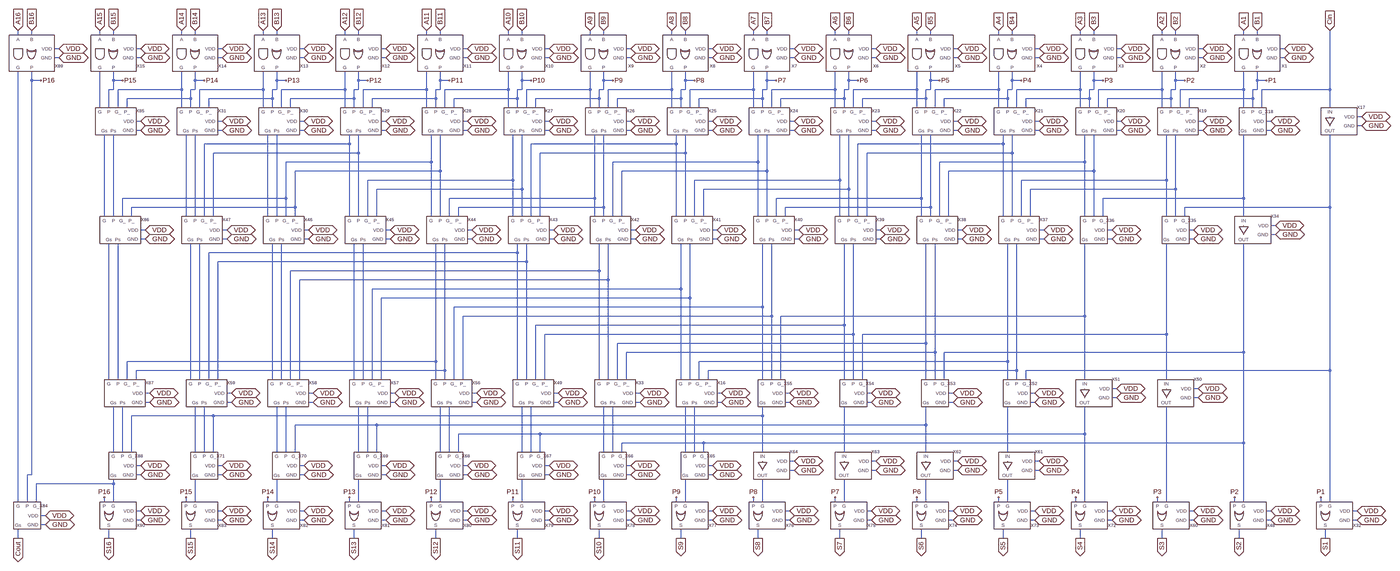
[diagram p0: schematic knowles.asc, whole sheet]
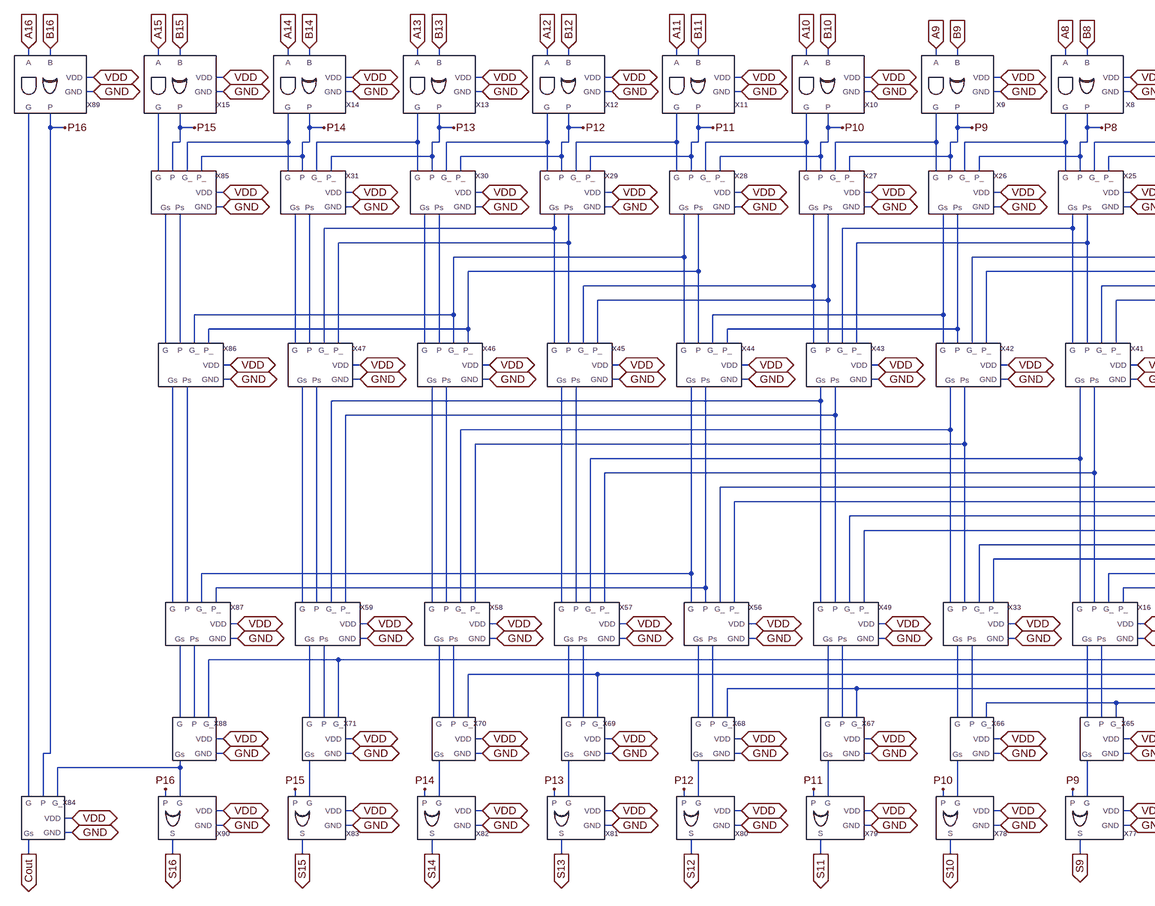
[diagram p1: schematic knowles.asc, part, row 1 of 1, column 1 of 2]
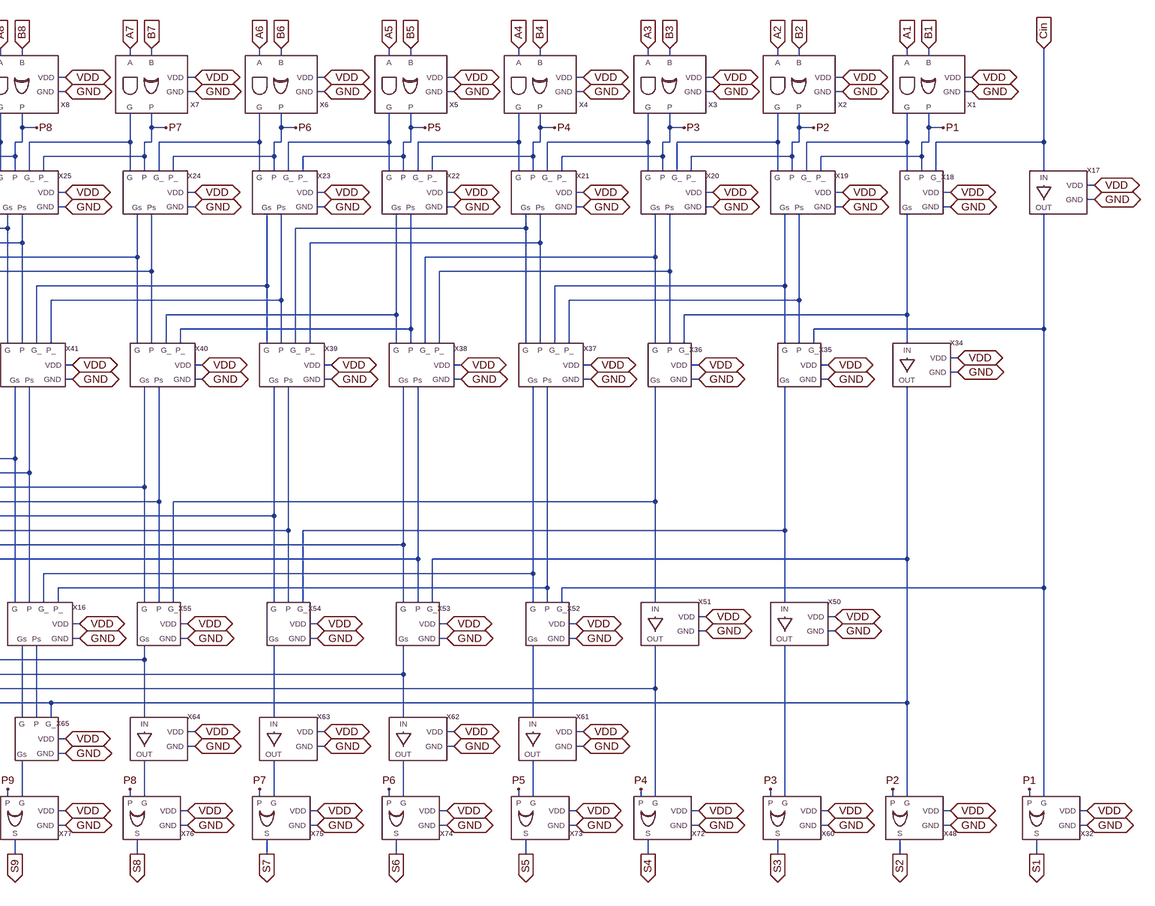
[diagram p2: schematic knowles.asc, part, row 1 of 1, column 2 of 2]
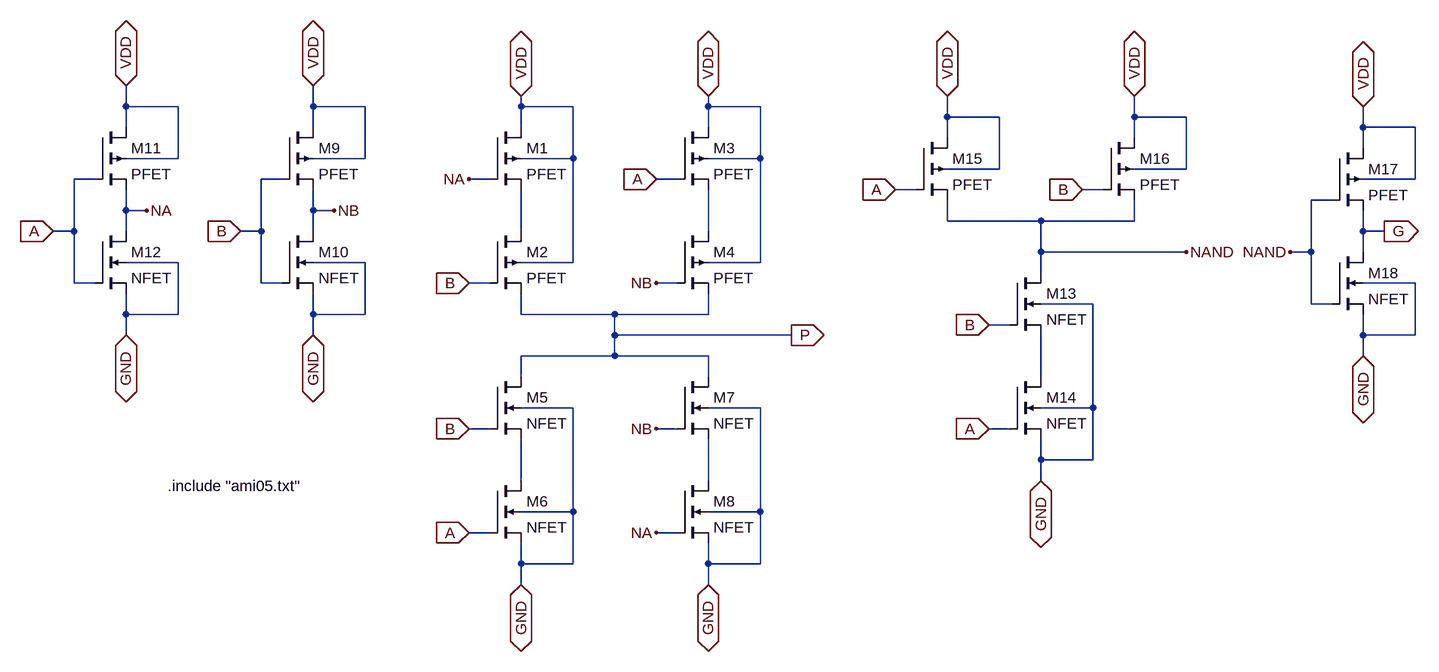
[diagram p3: sub-circuit bitwise.asc]
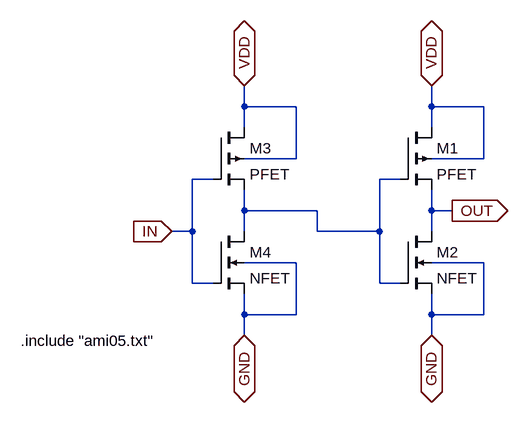
[diagram p4: sub-circuit buffer.asc]
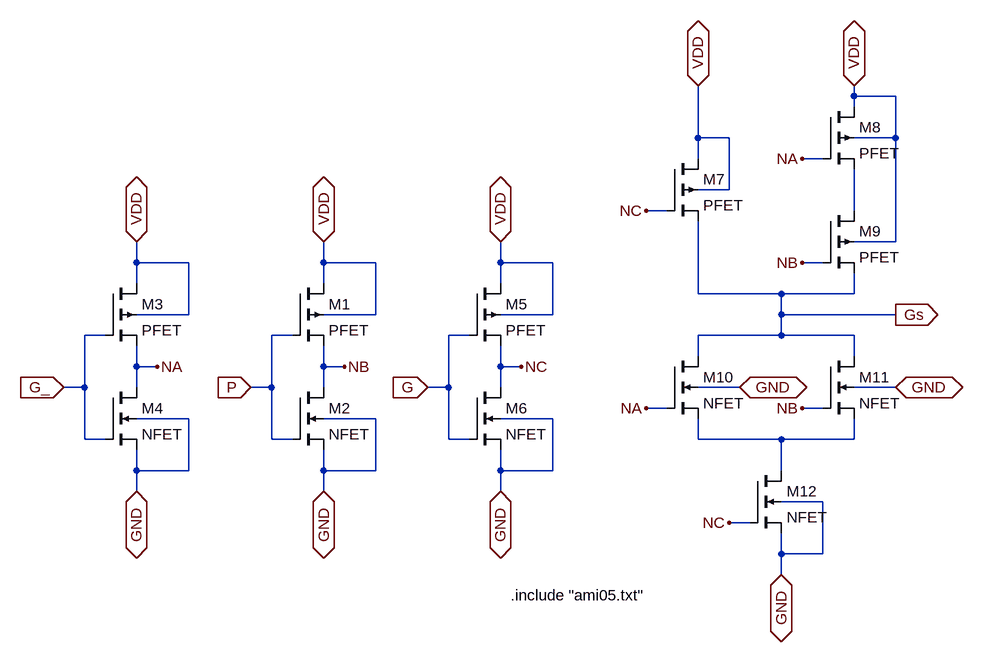
[diagram p5: sub-circuit gray.asc]
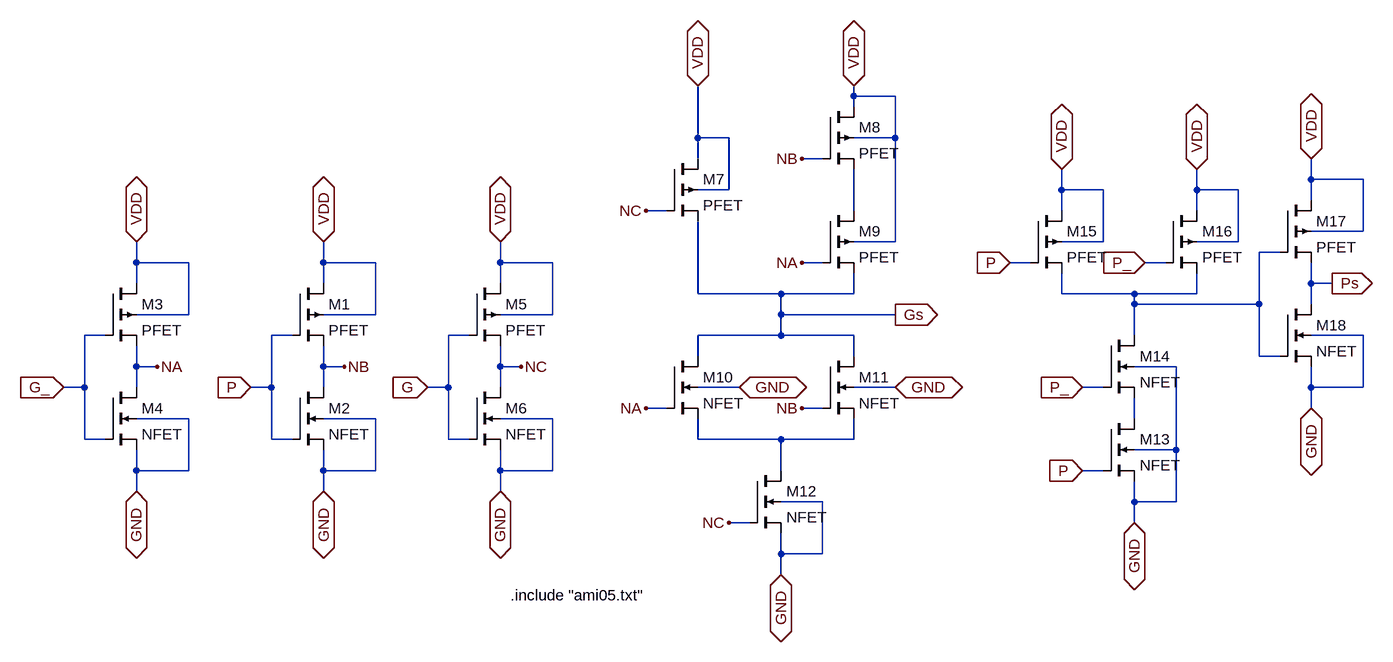
[diagram p6: sub-circuit black.asc]
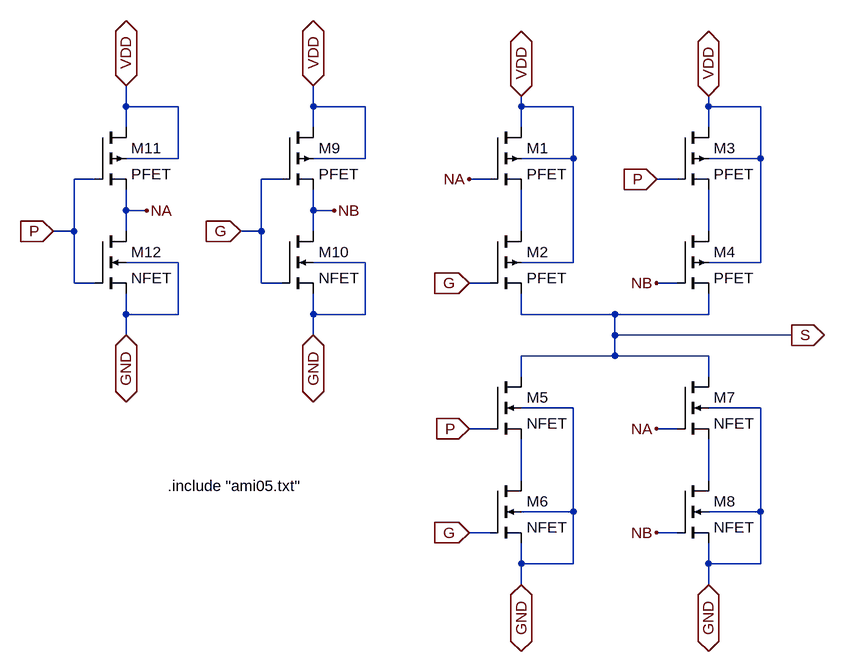
[diagram p7: sub-circuit sum.asc]
knowles.asc, the LTspice schematic file:
Version 4
SHEET 1 880 2148
WIRE -4144 64 -4144 48
WIRE -4096 64 -4096 48
WIRE -3856 64 -3856 48
WIRE -3808 64 -3808 48
WIRE -3568 64 -3568 48
WIRE -3520 64 -3520 48
WIRE -3280 64 -3280 48
WIRE -3232 64 -3232 48
WIRE -2992 64 -2992 48
WIRE -2944 64 -2944 48
WIRE -2704 64 -2704 48
WIRE -2656 64 -2656 48
WIRE -2416 64 -2416 48
WIRE -2368 64 -2368 48
WIRE -2128 64 -2128 48
WIRE -2080 64 -2080 48
WIRE -1840 64 -1840 48
WIRE -1792 64 -1792 48
WIRE -1552 64 -1552 48
WIRE -1504 64 -1504 48
WIRE -1264 64 -1264 48
WIRE -1216 64 -1216 48
WIRE -976 64 -976 48
WIRE -928 64 -928 48
WIRE -688 64 -688 48
WIRE -640 64 -640 48
WIRE -400 64 -400 48
WIRE -352 64 -352 48
WIRE -112 64 -112 48
WIRE -64 64 -64 48
WIRE 176 64 176 48
WIRE 224 64 224 48
WIRE -4000 112 -4016 112
WIRE -3712 112 -3728 112
WIRE -3424 112 -3440 112
WIRE -3136 112 -3152 112
WIRE -2848 112 -2864 112
WIRE -2560 112 -2576 112
WIRE -2272 112 -2288 112
WIRE -1984 112 -2000 112
WIRE -1696 112 -1712 112
WIRE -1408 112 -1424 112
WIRE -1120 112 -1136 112
WIRE -832 112 -848 112
WIRE -544 112 -560 112
WIRE -256 112 -272 112
WIRE 32 112 16 112
WIRE 320 112 304 112
WIRE -4000 144 -4016 144
WIRE -3712 144 -3728 144
WIRE -3424 144 -3440 144
WIRE -3136 144 -3152 144
WIRE -2848 144 -2864 144
WIRE -2560 144 -2576 144
WIRE -2272 144 -2288 144
WIRE -1984 144 -2000 144
WIRE -1696 144 -1712 144
WIRE -1408 144 -1424 144
WIRE -1120 144 -1136 144
WIRE -832 144 -848 144
WIRE -544 144 -560 144
WIRE -256 144 -272 144
WIRE 32 144 16 144
WIRE 320 144 304 144
WIRE -4096 224 -4096 192
WIRE -4064 224 -4096 224
WIRE -3808 224 -3808 192
WIRE -3776 224 -3808 224
WIRE -3520 224 -3520 192
WIRE -3488 224 -3520 224
WIRE -3232 224 -3232 192
WIRE -3200 224 -3232 224
WIRE -2944 224 -2944 192
WIRE -2912 224 -2944 224
WIRE -2656 224 -2656 192
WIRE -2624 224 -2656 224
WIRE -2368 224 -2368 192
WIRE -2336 224 -2368 224
WIRE -2080 224 -2080 192
WIRE -2048 224 -2080 224
WIRE -1792 224 -1792 192
WIRE -1760 224 -1792 224
WIRE -1504 224 -1504 192
WIRE -1472 224 -1504 224
WIRE -1216 224 -1216 192
WIRE -1184 224 -1216 224
WIRE -928 224 -928 192
WIRE -896 224 -928 224
WIRE -640 224 -640 192
WIRE -608 224 -640 224
WIRE -352 224 -352 192
WIRE -320 224 -352 224
WIRE -64 224 -64 192
WIRE -32 224 -64 224
WIRE 224 224 224 192
WIRE 256 224 224 224
WIRE -3808 256 -3808 224
WIRE -3808 256 -3824 256
WIRE -3568 256 -3568 192
WIRE -3568 256 -3792 256
WIRE -3520 256 -3520 224
WIRE -3520 256 -3536 256
WIRE -3280 256 -3280 192
WIRE -3280 256 -3504 256
WIRE -3232 256 -3232 224
WIRE -3232 256 -3248 256
WIRE -2992 256 -2992 192
WIRE -2992 256 -3216 256
WIRE -2944 256 -2944 224
WIRE -2944 256 -2960 256
WIRE -2704 256 -2704 192
WIRE -2704 256 -2928 256
WIRE -2656 256 -2656 224
WIRE -2656 256 -2672 256
WIRE -2416 256 -2416 192
WIRE -2416 256 -2640 256
WIRE -2368 256 -2368 224
WIRE -2368 256 -2384 256
WIRE -2128 256 -2128 192
WIRE -2128 256 -2352 256
WIRE -2080 256 -2080 224
WIRE -2080 256 -2096 256
WIRE -1840 256 -1840 192
WIRE -1840 256 -2064 256
WIRE -1792 256 -1792 224
WIRE -1792 256 -1808 256
WIRE -1552 256 -1552 192
WIRE -1552 256 -1776 256
WIRE -1504 256 -1504 224
WIRE -1504 256 -1520 256
WIRE -1264 256 -1264 192
WIRE -1264 256 -1488 256
WIRE -1216 256 -1216 224
WIRE -1216 256 -1232 256
WIRE -976 256 -976 192
WIRE -976 256 -1200 256
WIRE -928 256 -928 224
WIRE -928 256 -944 256
WIRE -688 256 -688 192
WIRE -688 256 -912 256
WIRE -640 256 -640 224
WIRE -640 256 -656 256
WIRE -400 256 -400 192
WIRE -400 256 -624 256
WIRE -352 256 -352 224
WIRE -352 256 -368 256
WIRE -112 256 -112 192
WIRE -112 256 -336 256
WIRE -64 256 -64 224
WIRE -64 256 -80 256
WIRE 176 256 176 192
WIRE 176 256 -48 256
WIRE 224 256 224 224
WIRE 224 256 208 256
WIRE 480 256 480 48
WIRE 480 256 240 256
WIRE -3536 288 -3536 256
WIRE -3536 288 -3760 288
WIRE -3248 288 -3248 256
WIRE -3248 288 -3472 288
WIRE -2960 288 -2960 256
WIRE -2960 288 -3184 288
WIRE -2672 288 -2672 256
WIRE -2672 288 -2896 288
WIRE -2384 288 -2384 256
WIRE -2384 288 -2608 288
WIRE -2096 288 -2096 256
WIRE -2096 288 -2320 288
WIRE -1808 288 -1808 256
WIRE -1808 288 -2032 288
WIRE -1520 288 -1520 256
WIRE -1520 288 -1744 288
WIRE -1232 288 -1232 256
WIRE -1232 288 -1456 288
WIRE -944 288 -944 256
WIRE -944 288 -1168 288
WIRE -656 288 -656 256
WIRE -656 288 -880 288
WIRE -368 288 -368 256
WIRE -368 288 -592 288
WIRE -80 288 -80 256
WIRE -80 288 -304 288
WIRE 208 288 208 256
WIRE 208 288 -16 288
WIRE -3856 320 -3856 192
WIRE -3824 320 -3824 256
WIRE -3792 320 -3792 256
WIRE -3760 320 -3760 288
WIRE -3568 320 -3568 256
WIRE -3536 320 -3536 288
WIRE -3504 320 -3504 256
WIRE -3472 320 -3472 288
WIRE -3280 320 -3280 256
WIRE -3248 320 -3248 288
WIRE -3216 320 -3216 256
WIRE -3184 320 -3184 288
WIRE -2992 320 -2992 256
WIRE -2960 320 -2960 288
WIRE -2928 320 -2928 256
WIRE -2896 320 -2896 288
WIRE -2704 320 -2704 256
WIRE -2672 320 -2672 288
WIRE -2640 320 -2640 256
WIRE -2608 320 -2608 288
WIRE -2416 320 -2416 256
WIRE -2384 320 -2384 288
WIRE -2352 320 -2352 256
WIRE -2320 320 -2320 288
WIRE -2128 320 -2128 256
WIRE -2096 320 -2096 288
WIRE -2064 320 -2064 256
WIRE -2032 320 -2032 288
WIRE -1840 320 -1840 256
WIRE -1808 320 -1808 288
WIRE -1776 320 -1776 256
WIRE -1744 320 -1744 288
WIRE -1552 320 -1552 256
WIRE -1520 320 -1520 288
WIRE -1488 320 -1488 256
WIRE -1456 320 -1456 288
WIRE -1264 320 -1264 256
WIRE -1232 320 -1232 288
WIRE -1200 320 -1200 256
WIRE -1168 320 -1168 288
WIRE -976 320 -976 256
WIRE -944 320 -944 288
WIRE -912 320 -912 256
WIRE -880 320 -880 288
WIRE -688 320 -688 256
WIRE -656 320 -656 288
WIRE -624 320 -624 256
WIRE -592 320 -592 288
WIRE -400 320 -400 256
WIRE -368 320 -368 288
WIRE -336 320 -336 256
WIRE -304 320 -304 288
WIRE -112 320 -112 256
WIRE -80 320 -80 288
WIRE -48 320 -48 256
WIRE -16 320 -16 288
WIRE 176 320 176 256
WIRE 208 320 208 288
WIRE 240 320 240 256
WIRE 480 320 480 256
WIRE 592 352 576 352
WIRE -3712 368 -3728 368
WIRE -3424 368 -3440 368
WIRE -3136 368 -3152 368
WIRE -2848 368 -2864 368
WIRE -2560 368 -2576 368
WIRE -2272 368 -2288 368
WIRE -1984 368 -2000 368
WIRE -1696 368 -1712 368
WIRE -1408 368 -1424 368
WIRE -1120 368 -1136 368
WIRE -832 368 -848 368
WIRE -544 368 -560 368
WIRE -256 368 -272 368
WIRE 32 368 16 368
WIRE 272 368 256 368
WIRE 592 384 576 384
WIRE -3712 400 -3728 400
WIRE -3424 400 -3440 400
WIRE -3136 400 -3152 400
WIRE -2848 400 -2864 400
WIRE -2560 400 -2576 400
WIRE -2272 400 -2288 400
WIRE -1984 400 -2000 400
WIRE -1696 400 -1712 400
WIRE -1408 400 -1424 400
WIRE -1120 400 -1136 400
WIRE -832 400 -848 400
WIRE -544 400 -560 400
WIRE -256 400 -272 400
WIRE 32 400 16 400
WIRE 272 400 256 400
WIRE -2976 448 -2976 416
WIRE -2976 448 -3488 448
WIRE -1824 448 -1824 416
WIRE -1824 448 -2336 448
WIRE -672 448 -672 416
WIRE -672 448 -1184 448
WIRE -2944 480 -2944 416
WIRE -2944 480 -3456 480
WIRE -1792 480 -1792 416
WIRE -1792 480 -2304 480
WIRE -640 480 -640 416
WIRE -640 480 -1152 480
WIRE -2688 512 -2688 416
WIRE -2688 512 -3200 512
WIRE -1536 512 -1536 416
WIRE -1536 512 -2048 512
WIRE -384 512 -384 416
WIRE -384 512 -896 512
WIRE -2656 544 -2656 416
WIRE -2656 544 -3168 544
WIRE -1504 544 -1504 416
WIRE -1504 544 -2016 544
WIRE -352 544 -352 416
WIRE -352 544 -864 544
WIRE -2400 576 -2400 416
WIRE -2400 576 -2912 576
WIRE -1248 576 -1248 416
WIRE -1248 576 -1760 576
WIRE -96 576 -96 416
WIRE -96 576 -608 576
WIRE -2368 608 -2368 416
WIRE -2368 608 -2880 608
WIRE -1216 608 -1216 416
WIRE -1216 608 -1728 608
WIRE -64 608 -64 416
WIRE -64 608 -576 608
WIRE -3200 640 -3200 512
WIRE -3200 640 -3776 640
WIRE -2112 640 -2112 416
WIRE -2112 640 -2624 640
WIRE -960 640 -960 416
WIRE -960 640 -1472 640
WIRE 176 640 176 416
WIRE 176 640 -320 640
WIRE -3168 672 -3168 544
WIRE -3168 672 -3744 672
WIRE -2080 672 -2080 416
WIRE -2080 672 -2592 672
WIRE -928 672 -928 416
WIRE -928 672 -1440 672
WIRE 480 672 480 416
WIRE 480 672 -32 672
WIRE -3840 704 -3840 416
WIRE -3808 704 -3808 416
WIRE -3776 704 -3776 640
WIRE -3744 704 -3744 672
WIRE -3552 704 -3552 416
WIRE -3520 704 -3520 416
WIRE -3488 704 -3488 448
WIRE -3456 704 -3456 480
WIRE -3264 704 -3264 416
WIRE -3232 704 -3232 416
WIRE -3200 704 -3200 640
WIRE -3168 704 -3168 672
WIRE -2976 704 -2976 448
WIRE -2944 704 -2944 480
WIRE -2912 704 -2912 576
WIRE -2880 704 -2880 608
WIRE -2688 704 -2688 512
WIRE -2656 704 -2656 544
WIRE -2624 704 -2624 640
WIRE -2592 704 -2592 672
WIRE -2400 704 -2400 576
WIRE -2368 704 -2368 608
WIRE -2336 704 -2336 448
WIRE -2304 704 -2304 480
WIRE -2112 704 -2112 640
WIRE -2080 704 -2080 672
WIRE -2048 704 -2048 512
WIRE -2016 704 -2016 544
WIRE -1824 704 -1824 448
WIRE -1792 704 -1792 480
WIRE -1760 704 -1760 576
WIRE -1728 704 -1728 608
WIRE -1536 704 -1536 512
WIRE -1504 704 -1504 544
WIRE -1472 704 -1472 640
WIRE -1440 704 -1440 672
WIRE -1248 704 -1248 576
WIRE -1216 704 -1216 608
WIRE -1184 704 -1184 448
WIRE -1152 704 -1152 480
WIRE -960 704 -960 640
WIRE -928 704 -928 672
WIRE -896 704 -896 512
WIRE -864 704 -864 544
WIRE -672 704 -672 448
WIRE -640 704 -640 480
WIRE -608 704 -608 576
WIRE -576 704 -576 608
WIRE -384 704 -384 512
WIRE -352 704 -352 544
WIRE -320 704 -320 640
WIRE -96 704 -96 576
WIRE -64 704 -64 608
WIRE -32 704 -32 672
WIRE 176 704 176 640
WIRE 288 736 272 736
WIRE -3696 752 -3712 752
WIRE -3408 752 -3424 752
WIRE -3120 752 -3136 752
WIRE -2832 752 -2848 752
WIRE -2544 752 -2560 752
WIRE -2256 752 -2272 752
WIRE -1968 752 -1984 752
WIRE -1680 752 -1696 752
WIRE -1392 752 -1408 752
WIRE -1104 752 -1120 752
WIRE -816 752 -832 752
WIRE -528 752 -544 752
WIRE -288 752 -304 752
WIRE 0 752 -16 752
WIRE 288 768 272 768
WIRE -3696 784 -3712 784
WIRE -3408 784 -3424 784
WIRE -3120 784 -3136 784
WIRE -2832 784 -2848 784
WIRE -2544 784 -2560 784
WIRE -2256 784 -2272 784
WIRE -1968 784 -1984 784
WIRE -1680 784 -1696 784
WIRE -1392 784 -1408 784
WIRE -1104 784 -1120 784
WIRE -816 784 -832 784
WIRE -528 784 -544 784
WIRE -288 784 -304 784
WIRE 0 784 -16 784
WIRE -2384 832 -2384 800
WIRE -2384 832 -3472 832
WIRE -2352 864 -2352 800
WIRE -2352 864 -3440 864
WIRE -2096 896 -2096 800
WIRE -2096 896 -3184 896
WIRE -2064 928 -2064 800
WIRE -2064 928 -3152 928
WIRE -1808 960 -1808 800
WIRE -1808 960 -2896 960
WIRE -1776 992 -1776 800
WIRE -1776 992 -2864 992
WIRE -1520 1024 -1520 800
WIRE -1520 1024 -2608 1024
WIRE -1488 1056 -1488 800
WIRE -1488 1056 -2576 1056
WIRE -384 1056 -384 800
WIRE -384 1056 -1456 1056
WIRE -1232 1088 -1232 800
WIRE -1232 1088 -2320 1088
WIRE -1200 1120 -1200 800
WIRE -1200 1120 -2288 1120
WIRE -96 1120 -96 800
WIRE -96 1120 -1168 1120
WIRE -944 1152 -944 800
WIRE -944 1152 -2032 1152
WIRE -912 1184 -912 800
WIRE -912 1184 -2000 1184
WIRE 176 1184 176 800
WIRE 176 1184 -880 1184
WIRE -2672 1216 -2672 800
WIRE -2672 1216 -3760 1216
WIRE -656 1216 -656 800
WIRE -656 1216 -1744 1216
WIRE -2640 1248 -2640 800
WIRE -2640 1248 -3728 1248
WIRE -624 1248 -624 800
WIRE -624 1248 -1712 1248
WIRE 480 1248 480 672
WIRE 480 1248 -592 1248
WIRE -3824 1280 -3824 800
WIRE -3792 1280 -3792 800
WIRE -3760 1280 -3760 1216
WIRE -3728 1280 -3728 1248
WIRE -3536 1280 -3536 800
WIRE -3504 1280 -3504 800
WIRE -3472 1280 -3472 832
WIRE -3440 1280 -3440 864
WIRE -3248 1280 -3248 800
WIRE -3216 1280 -3216 800
WIRE -3184 1280 -3184 896
WIRE -3152 1280 -3152 928
WIRE -2960 1280 -2960 800
WIRE -2928 1280 -2928 800
WIRE -2896 1280 -2896 960
WIRE -2864 1280 -2864 992
WIRE -2672 1280 -2672 1216
WIRE -2640 1280 -2640 1248
WIRE -2608 1280 -2608 1024
WIRE -2576 1280 -2576 1056
WIRE -2384 1280 -2384 832
WIRE -2352 1280 -2352 864
WIRE -2320 1280 -2320 1088
WIRE -2288 1280 -2288 1120
WIRE -2096 1280 -2096 896
WIRE -2064 1280 -2064 928
WIRE -2032 1280 -2032 1152
WIRE -2000 1280 -2000 1184
WIRE -1808 1280 -1808 960
WIRE -1776 1280 -1776 992
WIRE -1744 1280 -1744 1216
WIRE -1712 1280 -1712 1248
WIRE -1520 1280 -1520 1024
WIRE -1488 1280 -1488 1056
WIRE -1456 1280 -1456 1056
WIRE -1232 1280 -1232 1088
WIRE -1200 1280 -1200 1120
WIRE -1168 1280 -1168 1120
WIRE -944 1280 -944 1152
WIRE -912 1280 -912 1184
WIRE -880 1280 -880 1184
WIRE -656 1280 -656 1216
WIRE -624 1280 -624 1248
WIRE -592 1280 -592 1248
WIRE -384 1280 -384 1056
WIRE -96 1280 -96 1120
WIRE -272 1312 -288 1312
WIRE 16 1312 0 1312
WIRE -3680 1328 -3696 1328
WIRE -3392 1328 -3408 1328
WIRE -3104 1328 -3120 1328
WIRE -2816 1328 -2832 1328
WIRE -2528 1328 -2544 1328
WIRE -2240 1328 -2256 1328
WIRE -1952 1328 -1968 1328
WIRE -1664 1328 -1680 1328
WIRE -1424 1328 -1440 1328
WIRE -1136 1328 -1152 1328
WIRE -848 1328 -864 1328
WIRE -560 1328 -576 1328
WIRE -272 1344 -288 1344
WIRE 16 1344 0 1344
WIRE -3680 1360 -3696 1360
WIRE -3392 1360 -3408 1360
WIRE -3104 1360 -3120 1360
WIRE -2816 1360 -2832 1360
WIRE -2528 1360 -2544 1360
WIRE -2240 1360 -2256 1360
WIRE -1952 1360 -1968 1360
WIRE -1664 1360 -1680 1360
WIRE -1424 1360 -1440 1360
WIRE -1136 1360 -1152 1360
WIRE -848 1360 -864 1360
WIRE -560 1360 -576 1360
WIRE -3456 1408 -3744 1408
WIRE -1520 1408 -1520 1376
WIRE -1520 1408 -3456 1408
WIRE -2880 1440 -3168 1440
WIRE -944 1440 -944 1376
WIRE -944 1440 -2880 1440
WIRE -2304 1472 -2592 1472
WIRE -384 1472 -384 1376
WIRE -384 1472 -2304 1472
WIRE -1728 1504 -2016 1504
WIRE 176 1504 176 1184
WIRE 176 1504 -1728 1504
WIRE -3808 1536 -3808 1376
WIRE -3776 1536 -3776 1376
WIRE -3744 1536 -3744 1408
WIRE -3520 1536 -3520 1376
WIRE -3488 1536 -3488 1376
WIRE -3456 1536 -3456 1408
WIRE -3232 1536 -3232 1376
WIRE -3200 1536 -3200 1376
WIRE -3168 1536 -3168 1440
WIRE -2944 1536 -2944 1376
WIRE -2912 1536 -2912 1376
WIRE -2880 1536 -2880 1440
WIRE -2656 1536 -2656 1376
WIRE -2624 1536 -2624 1376
WIRE -2592 1536 -2592 1472
WIRE -2368 1536 -2368 1376
WIRE -2336 1536 -2336 1376
WIRE -2304 1536 -2304 1472
WIRE -2080 1536 -2080 1376
WIRE -2048 1536 -2048 1376
WIRE -2016 1536 -2016 1504
WIRE -1792 1536 -1792 1376
WIRE -1760 1536 -1760 1376
WIRE -1728 1536 -1728 1504
WIRE -1520 1536 -1520 1408
WIRE -1232 1536 -1232 1376
WIRE -944 1536 -944 1440
WIRE -656 1536 -656 1376
WIRE -1408 1568 -1424 1568
WIRE -1120 1568 -1136 1568
WIRE -832 1568 -848 1568
WIRE -544 1568 -560 1568
WIRE -3712 1584 -3728 1584
WIRE -3424 1584 -3440 1584
WIRE -3136 1584 -3152 1584
WIRE -2848 1584 -2864 1584
WIRE -2560 1584 -2576 1584
WIRE -2272 1584 -2288 1584
WIRE -1984 1584 -2000 1584
WIRE -1696 1584 -1712 1584
WIRE -1408 1600 -1424 1600
WIRE -1120 1600 -1136 1600
WIRE -832 1600 -848 1600
WIRE -544 1600 -560 1600
WIRE -4096 1616 -4096 224
WIRE -4096 1616 -4112 1616
WIRE -3712 1616 -3728 1616
WIRE -3424 1616 -3440 1616
WIRE -3136 1616 -3152 1616
WIRE -2848 1616 -2864 1616
WIRE -2560 1616 -2576 1616
WIRE -2272 1616 -2288 1616
WIRE -1984 1616 -2000 1616
WIRE -1696 1616 -1712 1616
WIRE -3808 1648 -3808 1632
WIRE -3808 1648 -4080 1648
WIRE -4144 1712 -4144 192
WIRE -4112 1712 -4112 1616
WIRE -4080 1712 -4080 1648
WIRE -3840 1712 -3840 1696
WIRE -3808 1712 -3808 1648
WIRE -3552 1712 -3552 1696
WIRE -3520 1712 -3520 1632
WIRE -3264 1712 -3264 1696
WIRE -3232 1712 -3232 1632
WIRE -2976 1712 -2976 1696
WIRE -2944 1712 -2944 1632
WIRE -2688 1712 -2688 1696
WIRE -2656 1712 -2656 1632
WIRE -2400 1712 -2400 1696
WIRE -2368 1712 -2368 1632
WIRE -2112 1712 -2112 1696
WIRE -2080 1712 -2080 1632
WIRE -1824 1712 -1824 1696
WIRE -1792 1712 -1792 1632
WIRE -1552 1712 -1552 1696
WIRE -1520 1712 -1520 1632
WIRE -1264 1712 -1264 1696
WIRE -1232 1712 -1232 1632
WIRE -976 1712 -976 1696
WIRE -944 1712 -944 1632
WIRE -688 1712 -688 1696
WIRE -656 1712 -656 1632
WIRE -416 1712 -416 1696
WIRE -384 1712 -384 1472
WIRE -128 1712 -128 1696
WIRE -96 1712 -96 1376
WIRE 144 1712 144 1696
WIRE 176 1712 176 1504
WIRE 448 1712 448 1696
WIRE 480 1712 480 1248
WIRE -3712 1744 -3728 1744
WIRE -3424 1744 -3440 1744
WIRE -3136 1744 -3152 1744
WIRE -2848 1744 -2864 1744
WIRE -2560 1744 -2576 1744
WIRE -2272 1744 -2288 1744
WIRE -1984 1744 -2000 1744
WIRE -1696 1744 -1712 1744
WIRE -1424 1744 -1440 1744
WIRE -1136 1744 -1152 1744
WIRE -848 1744 -864 1744
WIRE -560 1744 -576 1744
WIRE -288 1744 -304 1744
WIRE 0 1744 -16 1744
WIRE 272 1744 256 1744
WIRE 576 1744 560 1744
WIRE -4048 1760 -4064 1760
WIRE -3712 1776 -3728 1776
WIRE -3424 1776 -3440 1776
WIRE -3136 1776 -3152 1776
WIRE -2848 1776 -2864 1776
WIRE -2560 1776 -2576 1776
WIRE -2272 1776 -2288 1776
WIRE -1984 1776 -2000 1776
WIRE -1696 1776 -1712 1776
WIRE -1424 1776 -1440 1776
WIRE -1136 1776 -1152 1776
WIRE -848 1776 -864 1776
WIRE -560 1776 -576 1776
WIRE -288 1776 -304 1776
WIRE 0 1776 -16 1776
WIRE 272 1776 256 1776
WIRE 576 1776 560 1776
WIRE -4048 1792 -4064 1792
WIRE -4144 1840 -4144 1808
WIRE -3824 1840 -3824 1808
WIRE -3536 1840 -3536 1808
WIRE -3248 1840 -3248 1808
WIRE -2960 1840 -2960 1808
WIRE -2672 1840 -2672 1808
WIRE -2384 1840 -2384 1808
WIRE -2096 1840 -2096 1808
WIRE -1808 1840 -1808 1808
WIRE -1536 1840 -1536 1808
WIRE -1248 1840 -1248 1808
WIRE -960 1840 -960 1808
WIRE -672 1840 -672 1808
WIRE -400 1840 -400 1808
WIRE -112 1840 -112 1808
WIRE 160 1840 160 1808
WIRE 464 1840 464 1808
FLAG 320 112 VDD
IOPIN 320 112 BiDir
FLAG 320 144 GND
IOPIN 320 144 BiDir
FLAG 176 48 A1
IOPIN 176 48 In
FLAG 224 48 B1
IOPIN 224 48 In
FLAG 32 112 VDD
IOPIN 32 112 BiDir
FLAG 32 144 GND
IOPIN 32 144 BiDir
FLAG -112 48 A2
IOPIN -112 48 In
FLAG -64 48 B2
IOPIN -64 48 In
FLAG -256 112 VDD
IOPIN -256 112 BiDir
FLAG -256 144 GND
IOPIN -256 144 BiDir
FLAG -400 48 A3
IOPIN -400 48 In
FLAG -352 48 B3
IOPIN -352 48 In
FLAG -544 112 VDD
IOPIN -544 112 BiDir
FLAG -544 144 GND
IOPIN -544 144 BiDir
FLAG -688 48 A4
IOPIN -688 48 In
FLAG -640 48 B4
IOPIN -640 48 In
FLAG -832 112 VDD
IOPIN -832 112 BiDir
FLAG -832 144 GND
IOPIN -832 144 BiDir
FLAG -976 48 A5
IOPIN -976 48 In
FLAG -928 48 B5
IOPIN -928 48 In
FLAG -1120 112 VDD
IOPIN -1120 112 BiDir
FLAG -1120 144 GND
IOPIN -1120 144 BiDir
FLAG -1264 48 A6
IOPIN -1264 48 In
FLAG -1216 48 B6
IOPIN -1216 48 In
FLAG -1408 112 VDD
IOPIN -1408 112 BiDir
FLAG -1408 144 GND
IOPIN -1408 144 BiDir
FLAG -1552 48 A7
IOPIN -1552 48 In
FLAG -1504 48 B7
IOPIN -1504 48 In
FLAG -1696 112 VDD
IOPIN -1696 112 BiDir
FLAG -1696 144 GND
IOPIN -1696 144 BiDir
FLAG -1840 48 A8
IOPIN -1840 48 In
FLAG -1792 48 B8
IOPIN -1792 48 In
FLAG -1984 112 VDD
IOPIN -1984 112 BiDir
FLAG -1984 144 GND
IOPIN -1984 144 BiDir
FLAG -2128 48 A9
IOPIN -2128 48 In
FLAG -2080 48 B9
IOPIN -2080 48 In
FLAG -2272 112 VDD
IOPIN -2272 112 BiDir
FLAG -2272 144 GND
IOPIN -2272 144 BiDir
FLAG -2416 48 A10
IOPIN -2416 48 In
FLAG -2368 48 B10
IOPIN -2368 48 In
FLAG -2560 112 VDD
IOPIN -2560 112 BiDir
FLAG -2560 144 GND
IOPIN -2560 144 BiDir
FLAG -2704 48 A11
IOPIN -2704 48 In
FLAG -2656 48 B11
IOPIN -2656 48 In
FLAG -2848 112 VDD
IOPIN -2848 112 BiDir
FLAG -2848 144 GND
IOPIN -2848 144 BiDir
FLAG -2992 48 A12
IOPIN -2992 48 In
FLAG -2944 48 B12
IOPIN -2944 48 In
FLAG -3136 112 VDD
IOPIN -3136 112 BiDir
FLAG -3136 144 GND
IOPIN -3136 144 BiDir
FLAG -3280 48 A13
IOPIN -3280 48 In
FLAG -3232 48 B13
IOPIN -3232 48 In
FLAG -3424 112 VDD
IOPIN -3424 112 BiDir
FLAG -3424 144 GND
IOPIN -3424 144 BiDir
FLAG -3568 48 A14
IOPIN -3568 48 In
FLAG -3520 48 B14
IOPIN -3520 48 In
FLAG -3712 112 VDD
IOPIN -3712 112 BiDir
FLAG -3712 144 GND
IOPIN -3712 144 BiDir
FLAG -3856 48 A15
IOPIN -3856 48 In
FLAG -3808 48 B15
IOPIN -3808 48 In
FLAG 480 48 Cin
IOPIN 480 48 In
FLAG 592 352 VDD
IOPIN 592 352 BiDir
FLAG 592 384 GND
IOPIN 592 384 BiDir
FLAG 272 368 VDD
IOPIN 272 368 BiDir
FLAG 272 400 GND
IOPIN 272 400 BiDir
FLAG 288 736 VDD
IOPIN 288 736 BiDir
FLAG 288 768 GND
IOPIN 288 768 BiDir
FLAG 0 752 VDD
IOPIN 0 752 BiDir
FLAG 0 784 GND
IOPIN 0 784 BiDir
FLAG -288 752 VDD
IOPIN -288 752 BiDir
FLAG -288 784 GND
IOPIN -288 784 BiDir
FLAG 32 368 VDD
IOPIN 32 368 BiDir
FLAG 32 400 GND
IOPIN 32 400 BiDir
FLAG -256 368 VDD
IOPIN -256 368 BiDir
FLAG -256 400 GND
IOPIN -256 400 BiDir
FLAG -544 368 VDD
IOPIN -544 368 BiDir
FLAG -544 400 GND
IOPIN -544 400 BiDir
FLAG -832 368 VDD
IOPIN -832 368 BiDir
FLAG -832 400 GND
IOPIN -832 400 BiDir
FLAG -1120 368 VDD
IOPIN -1120 368 BiDir
FLAG -1120 400 GND
IOPIN -1120 400 BiDir
FLAG -1408 368 VDD
IOPIN -1408 368 BiDir
FLAG -1408 400 GND
IOPIN -1408 400 BiDir
FLAG -1696 368 VDD
IOPIN -1696 368 BiDir
FLAG -1696 400 GND
IOPIN -1696 400 BiDir
FLAG -1984 368 VDD
IOPIN -1984 368 BiDir
FLAG -1984 400 GND
IOPIN -1984 400 BiDir
FLAG -2272 368 VDD
IOPIN -2272 368 BiDir
FLAG -2272 400 GND
IOPIN -2272 400 BiDir
FLAG -2560 368 VDD
IOPIN -2560 368 BiDir
FLAG -2560 400 GND
IOPIN -2560 400 BiDir
FLAG -2848 368 VDD
IOPIN -2848 368 BiDir
FLAG -2848 400 GND
IOPIN -2848 400 BiDir
FLAG -3136 368 VDD
IOPIN -3136 368 BiDir
FLAG -3136 400 GND
IOPIN -3136 400 BiDir
FLAG -3424 368 VDD
IOPIN -3424 368 BiDir
FLAG -3424 400 GND
IOPIN -3424 400 BiDir
FLAG -528 752 VDD
IOPIN -528 752 BiDir
FLAG -528 784 GND
IOPIN -528 784 BiDir
FLAG -816 752 VDD
IOPIN -816 752 BiDir
FLAG -816 784 GND
IOPIN -816 784 BiDir
FLAG -1104 752 VDD
IOPIN -1104 752 BiDir
FLAG -1104 784 GND
IOPIN -1104 784 BiDir
FLAG -1392 752 VDD
IOPIN -1392 752 BiDir
FLAG -1392 784 GND
IOPIN -1392 784 BiDir
FLAG -1680 752 VDD
IOPIN -1680 752 BiDir
FLAG -1680 784 GND
IOPIN -1680 784 BiDir
FLAG -1968 752 VDD
IOPIN -1968 752 BiDir
FLAG -1968 784 GND
IOPIN -1968 784 BiDir
FLAG -2256 752 VDD
IOPIN -2256 752 BiDir
FLAG -2256 784 GND
IOPIN -2256 784 BiDir
FLAG -2544 752 VDD
IOPIN -2544 752 BiDir
FLAG -2544 784 GND
IOPIN -2544 784 BiDir
FLAG -2832 752 VDD
IOPIN -2832 752 BiDir
FLAG -2832 784 GND
IOPIN -2832 784 BiDir
FLAG -3120 752 VDD
IOPIN -3120 752 BiDir
FLAG -3120 784 GND
IOPIN -3120 784 BiDir
FLAG -3408 752 VDD
IOPIN -3408 752 BiDir
FLAG -3408 784 GND
IOPIN -3408 784 BiDir
FLAG 16 1312 VDD
IOPIN 16 1312 BiDir
FLAG 16 1344 GND
IOPIN 16 1344 BiDir
FLAG -272 1312 VDD
IOPIN -272 1312 BiDir
FLAG -272 1344 GND
IOPIN -272 1344 BiDir
FLAG -560 1328 VDD
IOPIN -560 1328 BiDir
FLAG -560 1360 GND
IOPIN -560 1360 BiDir
FLAG -848 1328 VDD
IOPIN -848 1328 BiDir
FLAG -848 1360 GND
IOPIN -848 1360 BiDir
FLAG -1136 1328 VDD
IOPIN -1136 1328 BiDir
FLAG -1136 1360 GND
IOPIN -1136 1360 BiDir
FLAG -1424 1328 VDD
IOPIN -1424 1328 BiDir
FLAG -1424 1360 GND
IOPIN -1424 1360 BiDir
FLAG -1664 1328 VDD
IOPIN -1664 1328 BiDir
FLAG -1664 1360 GND
IOPIN -1664 1360 BiDir
FLAG -1952 1328 VDD
IOPIN -1952 1328 BiDir
FLAG -1952 1360 GND
IOPIN -1952 1360 BiDir
FLAG -2240 1328 VDD
IOPIN -2240 1328 BiDir
FLAG -2240 1360 GND
IOPIN -2240 1360 BiDir
FLAG -2528 1328 VDD
IOPIN -2528 1328 BiDir
FLAG -2528 1360 GND
IOPIN -2528 1360 BiDir
FLAG -2816 1328 VDD
IOPIN -2816 1328 BiDir
FLAG -2816 1360 GND
IOPIN -2816 1360 BiDir
FLAG -3104 1328 VDD
IOPIN -3104 1328 BiDir
FLAG -3104 1360 GND
IOPIN -3104 1360 BiDir
FLAG -3392 1328 VDD
IOPIN -3392 1328 BiDir
FLAG -3392 1360 GND
IOPIN -3392 1360 BiDir
FLAG -544 1568 VDD
IOPIN -544 1568 BiDir
FLAG -544 1600 GND
IOPIN -544 1600 BiDir
FLAG -832 1568 VDD
IOPIN -832 1568 BiDir
FLAG -832 1600 GND
IOPIN -832 1600 BiDir
FLAG -1120 1568 VDD
IOPIN -1120 1568 BiDir
FLAG -1120 1600 GND
IOPIN -1120 1600 BiDir
FLAG -1408 1568 VDD
IOPIN -1408 1568 BiDir
FLAG -1408 1600 GND
IOPIN -1408 1600 BiDir
FLAG -1696 1584 VDD
IOPIN -1696 1584 BiDir
FLAG -1696 1616 GND
IOPIN -1696 1616 BiDir
FLAG -1984 1584 VDD
IOPIN -1984 1584 BiDir
FLAG -1984 1616 GND
IOPIN -1984 1616 BiDir
FLAG -2272 1584 VDD
IOPIN -2272 1584 BiDir
FLAG -2272 1616 GND
IOPIN -2272 1616 BiDir
FLAG -2560 1584 VDD
IOPIN -2560 1584 BiDir
FLAG -2560 1616 GND
IOPIN -2560 1616 BiDir
FLAG -2848 1584 VDD
IOPIN -2848 1584 BiDir
FLAG -2848 1616 GND
IOPIN -2848 1616 BiDir
FLAG -3136 1584 VDD
IOPIN -3136 1584 BiDir
FLAG -3136 1616 GND
IOPIN -3136 1616 BiDir
FLAG -3424 1584 VDD
IOPIN -3424 1584 BiDir
FLAG -3424 1616 GND
IOPIN -3424 1616 BiDir
FLAG -3488 224 P14
FLAG -3200 224 P13
FLAG -2912 224 P12
FLAG -2624 224 P11
FLAG -2336 224 P10
FLAG -2048 224 P9
FLAG -1760 224 P8
FLAG -1472 224 P7
FLAG -1184 224 P6
FLAG -896 224 P5
FLAG -608 224 P4
FLAG -320 224 P3
FLAG -32 224 P2
FLAG 256 224 P1
FLAG -3776 224 P15
FLAG 576 1744 VDD
IOPIN 576 1744 BiDir
FLAG 576 1776 GND
IOPIN 576 1776 BiDir
FLAG 448 1696 P1
FLAG 272 1744 VDD
IOPIN 272 1744 BiDir
FLAG 272 1776 GND
IOPIN 272 1776 BiDir
FLAG 144 1696 P2
FLAG 0 1744 VDD
IOPIN 0 1744 BiDir
FLAG 0 1776 GND
IOPIN 0 1776 BiDir
FLAG -128 1696 P3
FLAG -288 1744 VDD
IOPIN -288 1744 BiDir
FLAG -288 1776 GND
IOPIN -288 1776 BiDir
FLAG -416 1696 P4
FLAG -560 1744 VDD
IOPIN -560 1744 BiDir
FLAG -560 1776 GND
IOPIN -560 1776 BiDir
FLAG -688 1696 P5
FLAG -848 1744 VDD
IOPIN -848 1744 BiDir
FLAG -848 1776 GND
IOPIN -848 1776 BiDir
FLAG -976 1696 P6
FLAG -1136 1744 VDD
IOPIN -1136 1744 BiDir
FLAG -1136 1776 GND
IOPIN -1136 1776 BiDir
FLAG -1264 1696 P7
FLAG -1424 1744 VDD
IOPIN -1424 1744 BiDir
FLAG -1424 1776 GND
IOPIN -1424 1776 BiDir
FLAG -1552 1696 P8
FLAG -1696 1744 VDD
IOPIN -1696 1744 BiDir
FLAG -1696 1776 GND
IOPIN -1696 1776 BiDir
FLAG -1824 1696 P9
FLAG -1984 1744 VDD
IOPIN -1984 1744 BiDir
FLAG -1984 1776 GND
IOPIN -1984 1776 BiDir
FLAG -2112 1696 P10
FLAG -2272 1744 VDD
IOPIN -2272 1744 BiDir
FLAG -2272 1776 GND
IOPIN -2272 1776 BiDir
FLAG -2400 1696 P11
FLAG -2560 1744 VDD
IOPIN -2560 1744 BiDir
FLAG -2560 1776 GND
IOPIN -2560 1776 BiDir
FLAG -2688 1696 P12
FLAG -2848 1744 VDD
IOPIN -2848 1744 BiDir
FLAG -2848 1776 GND
IOPIN -2848 1776 BiDir
FLAG -2976 1696 P13
FLAG -3136 1744 VDD
IOPIN -3136 1744 BiDir
FLAG -3136 1776 GND
IOPIN -3136 1776 BiDir
FLAG -3264 1696 P14
FLAG -3424 1744 VDD
IOPIN -3424 1744 BiDir
FLAG -3424 1776 GND
IOPIN -3424 1776 BiDir
FLAG -3552 1696 P15
FLAG -4048 1760 VDD
IOPIN -4048 1760 BiDir
FLAG -4048 1792 GND
IOPIN -4048 1792 BiDir
FLAG 464 1840 S1
IOPIN 464 1840 Out
FLAG 160 1840 S2
IOPIN 160 1840 Out
FLAG -112 1840 S3
IOPIN -112 1840 Out
FLAG -400 1840 S4
IOPIN -400 1840 Out
FLAG -672 1840 S5
IOPIN -672 1840 Out
FLAG -960 1840 S6
IOPIN -960 1840 Out
FLAG -1248 1840 S7
IOPIN -1248 1840 Out
FLAG -1536 1840 S8
IOPIN -1536 1840 Out
FLAG -1808 1840 S9
IOPIN -1808 1840 Out
FLAG -2096 1840 S10
IOPIN -2096 1840 Out
FLAG -2384 1840 S11
IOPIN -2384 1840 Out
FLAG -2672 1840 S12
IOPIN -2672 1840 Out
FLAG -2960 1840 S13
IOPIN -2960 1840 Out
FLAG -3248 1840 S14
IOPIN -3248 1840 Out
FLAG -3536 1840 S15
IOPIN -3536 1840 Out
FLAG -4144 1840 Cout
IOPIN -4144 1840 Out
FLAG -3712 368 VDD
IOPIN -3712 368 BiDir
FLAG -3712 400 GND
IOPIN -3712 400 BiDir
FLAG -3696 752 VDD
IOPIN -3696 752 BiDir
FLAG -3696 784 GND
IOPIN -3696 784 BiDir
FLAG -3680 1328 VDD
IOPIN -3680 1328 BiDir
FLAG -3680 1360 GND
IOPIN -3680 1360 BiDir
FLAG -3712 1584 VDD
IOPIN -3712 1584 BiDir
FLAG -3712 1616 GND
IOPIN -3712 1616 BiDir
FLAG -4000 112 VDD
IOPIN -4000 112 BiDir
FLAG -4000 144 GND
IOPIN -4000 144 BiDir
FLAG -4144 48 A16
IOPIN -4144 48 In
FLAG -4096 48 B16
IOPIN -4096 48 In
FLAG -3712 1744 VDD
IOPIN -3712 1744 BiDir
FLAG -3712 1776 GND
IOPIN -3712 1776 BiDir
FLAG -3840 1696 P16
FLAG -3824 1840 S16
IOPIN -3824 1840 Out
FLAG -4064 224 P16
SYMBOL bitwise 352 144 R0
SYMATTR InstName X1
SYMBOL bitwise 64 144 R0
SYMATTR InstName X2
SYMBOL bitwise -224 144 R0
SYMATTR InstName X3
SYMBOL bitwise -512 144 R0
SYMATTR InstName X4
SYMBOL bitwise -800 144 R0
SYMATTR InstName X5
SYMBOL bitwise -1088 144 R0
SYMATTR InstName X6
SYMBOL bitwise -1376 144 R0
SYMATTR InstName X7
SYMBOL bitwise -1664 144 R0
SYMATTR InstName X8
SYMBOL bitwise -1952 144 R0
SYMATTR InstName X9
SYMBOL bitwise -2240 144 R0
SYMATTR InstName X10
SYMBOL bitwise -2528 144 R0
SYMATTR InstName X11
SYMBOL bitwise -2816 144 R0
SYMATTR InstName X12
SYMBOL bitwise -3104 144 R0
SYMATTR InstName X13
SYMBOL bitwise -3392 144 R0
SYMATTR InstName X14
SYMBOL bitwise -3680 144 R0
SYMATTR InstName X15
SYMBOL buffer 528 384 R0
SYMATTR InstName X17
SYMBOL gray 256 368 R0
SYMATTR InstName X18
SYMBOL black 80 400 R0
SYMATTR InstName X19
SYMBOL black -208 400 R0
SYMATTR InstName X20
SYMBOL black -496 400 R0
SYMATTR InstName X21
SYMBOL black -784 400 R0
SYMATTR InstName X22
SYMBOL black -1072 400 R0
SYMATTR InstName X23
SYMBOL black -1360 400 R0
SYMATTR InstName X24
SYMBOL black -1648 400 R0
SYMATTR InstName X25
SYMBOL black -1936 400 R0
SYMATTR InstName X26
SYMBOL black -2224 400 R0
SYMATTR InstName X27
SYMBOL black -2512 400 R0
SYMATTR InstName X28
SYMBOL black -2800 400 R0
SYMATTR InstName X29
SYMBOL black -3088 400 R0
SYMATTR InstName X30
SYMBOL black -3376 400 R0
SYMATTR InstName X31
SYMBOL buffer 224 768 R0
SYMATTR InstName X34
SYMBOL gray -16 752 R0
SYMATTR InstName X35
SYMBOL gray -304 752 R0
SYMATTR InstName X36
SYMBOL black -480 784 R0
SYMATTR InstName X37
SYMBOL black -768 784 R0
SYMATTR InstName X38
SYMBOL black -1056 784 R0
SYMATTR InstName X39
SYMBOL black -1344 784 R0
SYMATTR InstName X40
SYMBOL black -1632 784 R0
SYMATTR InstName X41
SYMBOL black -1920 784 R0
SYMATTR InstName X42
SYMBOL black -2208 784 R0
SYMATTR InstName X43
SYMBOL black -2496 784 R0
SYMATTR InstName X44
SYMBOL black -2784 784 R0
SYMATTR InstName X45
SYMBOL black -3072 784 R0
SYMATTR InstName X46
SYMBOL black -3360 784 R0
SYMATTR InstName X47
SYMBOL buffer -48 1344 R0
SYMATTR InstName X50
SYMBOL buffer -336 1344 R0
SYMATTR InstName X51
SYMBOL gray -576 1328 R0
SYMATTR InstName X52
SYMBOL gray -864 1328 R0
SYMATTR InstName X53
SYMBOL gray -1152 1328 R0
SYMATTR InstName X54
SYMBOL gray -1440 1328 R0
SYMATTR InstName X55
SYMBOL black -1616 1360 R0
SYMATTR InstName X16
SYMBOL black -1904 1360 R0
SYMATTR InstName X33
SYMBOL black -2192 1360 R0
SYMATTR InstName X49
SYMBOL black -2480 1360 R0
SYMATTR InstName X56
SYMBOL black -2768 1360 R0
SYMATTR InstName X57
SYMBOL black -3056 1360 R0
SYMATTR InstName X58
SYMBOL black -3344 1360 R0
SYMATTR InstName X59
SYMBOL buffer -608 1600 R0
SYMATTR InstName X61
SYMBOL buffer -896 1600 R0
SYMATTR InstName X62
SYMBOL buffer -1184 1600 R0
SYMATTR InstName X63
SYMBOL buffer -1472 1600 R0
SYMATTR InstName X64
SYMBOL gray -1712 1584 R0
SYMATTR InstName X65
SYMBOL gray -2000 1584 R0
SYMATTR InstName X66
SYMBOL gray -2288 1584 R0
SYMATTR InstName X67
SYMBOL gray -2576 1584 R0
SYMATTR InstName X68
SYMBOL gray -2864 1584 R0
SYMATTR InstName X69
SYMBOL gray -3152 1584 R0
SYMATTR InstName X70
SYMBOL gray -3440 1584 R0
SYMATTR InstName X71
SYMBOL sum 512 1808 R0
SYMATTR InstName X32
SYMBOL sum 208 1808 R0
SYMATTR InstName X48
SYMBOL sum -64 1808 R0
SYMATTR InstName X60
SYMBOL sum -352 1808 R0
SYMATTR InstName X72
SYMBOL sum -624 1808 R0
SYMATTR InstName X73
SYMBOL sum -912 1808 R0
SYMATTR InstName X74
SYMBOL sum -1200 1808 R0
SYMATTR InstName X75
SYMBOL sum -1488 1808 R0
SYMATTR InstName X76
SYMBOL sum -1760 1808 R0
SYMATTR InstName X77
SYMBOL sum -2048 1808 R0
SYMATTR InstName X78
SYMBOL sum -2336 1808 R0
SYMATTR InstName X79
SYMBOL sum -2624 1808 R0
SYMATTR InstName X80
SYMBOL sum -2912 1808 R0
SYMATTR InstName X81
SYMBOL sum -3200 1808 R0
SYMATTR InstName X82
SYMBOL sum -3488 1808 R0
SYMATTR InstName X83
SYMBOL gray -4064 1760 R0
SYMATTR InstName X84
SYMBOL black -3664 400 R0
SYMATTR InstName X85
SYMBOL black -3648 784 R0
SYMATTR InstName X86
SYMBOL black -3632 1360 R0
SYMATTR InstName X87
SYMBOL gray -3728 1584 R0
SYMATTR InstName X88
SYMBOL bitwise -3968 144 R0
SYMATTR InstName X89
SYMBOL sum -3776 1808 R0
SYMATTR InstName X90

The netlist it stands for:
* knowles.asc
XX1 A1 B1 N014 GND P1 VDD bitwise
XX2 A2 B2 N013 GND P2 VDD bitwise
XX3 A3 B3 N012 GND P3 VDD bitwise
XX4 A4 B4 N011 GND P4 VDD bitwise
XX5 A5 B5 N010 GND P5 VDD bitwise
XX6 A6 B6 N009 GND P6 VDD bitwise
XX7 A7 B7 N008 GND P7 VDD bitwise
XX8 A8 B8 N007 GND P8 VDD bitwise
XX9 A9 B9 N006 GND P9 VDD bitwise
XX10 A10 B10 N005 GND P10 VDD bitwise
XX11 A11 B11 N004 GND P11 VDD bitwise
XX12 A12 B12 N003 GND P12 VDD bitwise
XX13 A13 B13 N002 GND P13 VDD bitwise
XX14 A14 B14 N001 GND P14 VDD bitwise
XX15 A15 B15 N015 GND P15 VDD bitwise
XX17 Cin GND N039 VDD buffer
XX18 N014 Cin P1 GND N036 VDD gray
XX19 N013 N014 P2 P1 GND N030 N033 VDD black
XX20 N012 N013 P3 P2 GND N024 N027 VDD black
XX21 N011 N012 P4 P3 GND N018 N021 VDD black
XX22 N010 N011 P5 P4 GND N035 N038 VDD black
XX23 N009 N010 P6 P5 GND N029 N032 VDD black
XX24 N008 N009 P7 P6 GND N023 N026 VDD black
XX25 N007 N008 P8 P7 GND N017 N020 VDD black
XX26 N006 N007 P9 P8 GND N034 N037 VDD black
XX27 N005 N006 P10 P9 GND N028 N031 VDD black
XX28 N004 N005 P11 P10 GND N022 N025 VDD black
XX29 N003 N004 P12 P11 GND N016 N019 VDD black
XX30 N002 N003 P13 P12 GND N044 N045 VDD black
XX31 N001 N002 P14 P13 GND N042 N043 VDD black
XX34 N036 GND N060 VDD buffer
XX35 N030 N039 N033 GND N057 VDD gray
XX36 N024 N036 N027 GND N054 VDD gray
XX37 N018 N030 N021 N033 GND N062 N064 VDD black
XX38 N035 N024 N038 N027 GND N058 N059 VDD black
XX39 N029 N018 N032 N021 GND N055 N056 VDD black
XX40 N023 N035 N026 N038 GND N052 N053 VDD black
XX41 N017 N029 N020 N032 GND N050 N051 VDD black
XX42 N034 N023 N037 N026 GND N048 N049 VDD black
XX43 N028 N017 N031 N020 GND N046 N047 VDD black
XX44 N022 N034 N025 N037 GND N061 N063 VDD black
XX45 N016 N028 N019 N031 GND N071 N072 VDD black
XX46 N044 N022 N045 N025 GND N069 N070 VDD black
XX47 N042 N016 N043 N019 GND N067 N068 VDD black
XX50 N057 GND N107 VDD buffer
XX51 N054 GND N075 VDD buffer
XX52 N062 N039 N064 GND N093 VDD gray
XX53 N058 N060 N059 GND N074 VDD gray
XX54 N055 N057 N056 GND N092 VDD gray
XX55 N052 N054 N053 GND N073 VDD gray
XX16 N050 N062 N051 N064 GND N090 N091 VDD black
XX33 N048 N058 N049 N059 GND N088 N089 VDD black
XX49 N046 N055 N047 N056 GND N086 N087 VDD black
XX56 N061 N052 N063 N053 GND N084 N085 VDD black
XX57 N071 N050 N072 N051 GND N082 N083 VDD black
XX58 N069 N048 N070 N049 GND N080 N081 VDD black
XX59 N067 N046 N068 N047 GND N078 N079 VDD black
XX61 N093 GND N106 VDD buffer
XX62 N074 GND N105 VDD buffer
XX63 N092 GND N104 VDD buffer
XX64 N073 GND N103 VDD buffer
XX65 N090 N060 N091 GND N102 VDD gray
XX66 N088 N060 N089 GND N101 VDD gray
XX67 N086 N075 N087 GND N100 VDD gray
XX68 N084 N075 N085 GND N099 VDD gray
XX69 N082 N074 N083 GND N098 VDD gray
XX70 N080 N074 N081 GND N097 VDD gray
XX71 N078 N073 N079 GND N096 VDD gray
XX32 P1 N039 GND S1 VDD sum
XX48 P2 N060 GND S2 VDD sum
XX60 P3 N107 GND S3 VDD sum
XX72 P4 N075 GND S4 VDD sum
XX73 P5 N106 GND S5 VDD sum
XX74 P6 N105 GND S6 VDD sum
XX75 P7 N104 GND S7 VDD sum
XX76 P8 N103 GND S8 VDD sum
XX77 P9 N102 GND S9 VDD sum
XX78 P10 N101 GND S10 VDD sum
XX79 P11 N100 GND S11 VDD sum
XX80 P12 N099 GND S12 VDD sum
XX81 P13 N098 GND S13 VDD sum
XX82 P14 N097 GND S14 VDD sum
XX83 P15 N096 GND S15 VDD sum
XX84 N095 N094 P16 GND Cout VDD gray
XX85 N015 N001 P15 P14 GND N040 N041 VDD black
XX86 N040 N022 N041 N025 GND N065 N066 VDD black
XX87 N065 N061 N066 N063 GND N076 N077 VDD black
XX88 N076 N073 N077 GND N094 VDD gray
XX89 A16 B16 N095 GND P16 VDD bitwise
XX90 P16 N094 GND S16 VDD sum

* block symbol definitions
.subckt bitwise A B G GND P VDD
M1 VDD NA N001 VDD PFET l=0.6u w=6u
M2 N001 B P VDD PFET l=0.6u w=6u
M3 VDD A N002 VDD PFET l=0.6u w=6u
M4 N002 NB P VDD PFET l=0.6u w=6u
M5 P B N004 GND NFET l=0.6u w=3u
M6 N004 A GND GND NFET l=0.6u w=3u
M7 P NB N005 GND NFET l=0.6u w=3u
M8 N005 NA GND GND NFET l=0.6u w=3u
M9 VDD B NB VDD PFET l=0.6u w=3u
M10 NB B GND GND NFET l=0.6u w=1.5u
M11 VDD A NA VDD PFET l=0.6u w=3u
M12 NA A GND GND NFET l=0.6u w=1.5u
M13 NAND B N003 GND NFET l=0.6u w=3u
M14 N003 A GND GND NFET l=0.6u w=3u
M15 VDD A NAND VDD PFET l=0.6u w=3u
M16 VDD B NAND VDD PFET l=0.6u w=3u
M17 VDD NAND G VDD PFET l=0.6u w=3u
M18 G NAND GND GND NFET l=0.6u w=1.5u
.include "ami05.txt"
.ends bitwise

.subckt buffer IN GND OUT VDD
M1 VDD N001 OUT VDD PFET l=0.6u w=3u
M2 OUT N001 GND GND NFET l=0.6u w=1.5u
M3 VDD IN N001 VDD PFET l=0.6u w=3u
M4 N001 IN GND GND NFET l=0.6u w=1.5u
.include "ami05.txt"
.ends buffer

.subckt gray G G_ P GND Gs VDD
M1 VDD P NB VDD PFET l=0.6u w=3u
M2 NB P GND GND NFET l=0.6u w=1.5u
M3 VDD G_ NA VDD PFET l=0.6u w=3u
M4 NA G_ GND GND NFET l=0.6u w=1.5u
M5 VDD G NC VDD PFET l=0.6u w=3u
M6 NC G GND GND NFET l=0.6u w=1.5u
M7 VDD NC Gs VDD PFET l=0.6u w=3u
M8 VDD NA N001 VDD PFET l=0.6u w=3u
M9 N001 NB Gs VDD PFET l=0.6u w=3u
M10 Gs NA N002 GND NFET l=0.6u w=1.5u
M11 Gs NB N002 GND NFET l=0.6u w=1.5u
M12 N002 NC GND GND NFET l=0.6u w=1.5u
.include "ami05.txt"
.ends gray

.subckt black G G_ P P_ GND Gs Ps VDD
M1 VDD P NB VDD PFET l=0.6u w=3u
M2 NB P GND GND NFET l=0.6u w=1.5u
M3 VDD G_ NA VDD PFET l=0.6u w=3u
M4 NA G_ GND GND NFET l=0.6u w=1.5u
M5 VDD G NC VDD PFET l=0.6u w=3u
M6 NC G GND GND NFET l=0.6u w=1.5u
M7 VDD NC Gs VDD PFET l=0.6u w=6u
M8 VDD NB N001 VDD PFET l=0.6u w=6u
M9 N001 NA Gs VDD PFET l=0.6u w=6u
M10 Gs NA N004 GND NFET l=0.6u w=3u
M11 Gs NB N004 GND NFET l=0.6u w=3u
M12 N004 NC GND GND NFET l=0.6u w=3u
M13 N003 P GND GND NFET l=0.6u w=3u
M14 N002 P_ N003 GND NFET l=0.6u w=3u
M15 VDD P N002 VDD PFET l=0.6u w=3u
M16 VDD P_ N002 VDD PFET l=0.6u w=3u
M17 VDD N002 Ps VDD PFET l=0.6u w=3u
M18 Ps N002 GND GND NFET l=0.6u w=1.5u
.include "ami05.txt"
.ends black

.subckt sum P G GND S VDD
M1 VDD NA N001 VDD PFET l=0.6u w=6u
M2 N001 G S VDD PFET l=0.6u w=6u
M3 VDD P N002 VDD PFET l=0.6u w=6u
M4 N002 NB S VDD PFET l=0.6u w=6u
M5 S P N003 GND NFET l=0.6u w=3u
M6 N003 G GND GND NFET l=0.6u w=3u
M7 S NA N004 GND NFET l=0.6u w=3u
M8 N004 NB GND GND NFET l=0.6u w=3u
M9 VDD G NB VDD PFET l=0.6u w=3u
M10 NB G GND GND NFET l=0.6u w=1.5u
M11 VDD P NA VDD PFET l=0.6u w=3u
M12 NA P GND GND NFET l=0.6u w=1.5u
.include "ami05.txt"
.ends sum

.model NMOS NMOS
.model PMOS PMOS
.lib standard.mos
.backanno
.end